# EAGLE design fac_relay (EAGLE 7.6.0)
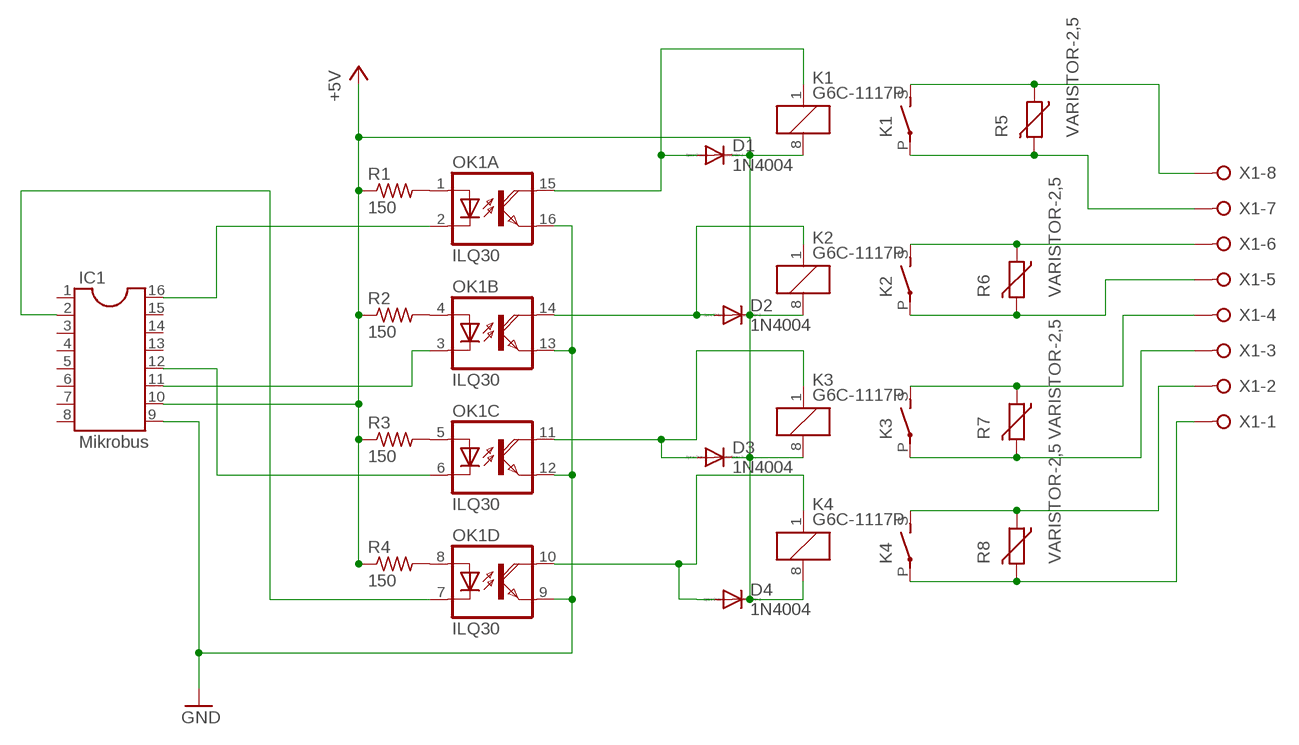
[diagram p0: schematic, sheet 1]

## Parts
D1  1N4004  [DO41-10]
D2  1N4004  [DO41-10]
D3  1N4004  [DO41-10]
D4  1N4004  [DO41-10]
IC1  Mikrobus  DIL16S  [SOCKET-16]
K1  G6C-1117P  [G6C-1117P]
K2  G6C-1117P  [G6C-1117P]
K3  G6C-1117P  [G6C-1117P]
K4  G6C-1117P  [G6C-1117P]
OK1  ILQ30  [DIL16]
R1  150  R-US_0204/5  [0204/5]
R2  150  R-US_0204/5  [0204/5]
R3  150  R-US_0204/5  [0204/5]
R4  150  R-US_0204/5  [0204/5]
R5  VARISTOR-2,5  [R-5]
R6  VARISTOR-2,5  [R-5]
R7  VARISTOR-2,5  [R-5]
R8  VARISTOR-2,5  [R-5]
X1  W237-08P  [W237-8P]

## Nets
+5V: D1.C D2.C D3.C D4.C IC1.10 K1.8 K2.8 K3.8 K4.8 R1.1 R2.1 R3.1 R4.1
GND: IC1.9 OK1.9(D:EMI) OK1.12(C:EMI) OK1.13(B:EMI) OK1.16(A:EMI)
N$1: OK1.1(A:A) R1.2
N$2: OK1.4(B:A) R2.2
N$3: OK1.5(C:A) R3.2
N$4: OK1.8(D:A) R4.2
N$5: IC1.16 OK1.2(A:C)
N$6: IC1.11 OK1.3(B:C)
N$7: IC1.12 OK1.6(C:C)
N$8: IC1.2 OK1.7(D:C)
N$9: K1.S(2:S) R5.1 X1.8
N$10: K1.P(2:P) R5.2 X1.7
N$11: D1.A K1.1 OK1.15(A:COL)
N$12: D2.A K2.1 OK1.14(B:COL)
N$13: D3.A K3.1 OK1.11(C:COL)
N$14: D4.A K4.1 OK1.10(D:COL)
N$15: K2.S(2:S) R6.1 X1.6
N$16: K2.P(2:P) R6.2 X1.5
N$17: K3.S(2:S) R7.1 X1.4
N$18: K3.P(2:P) R7.2 X1.3
N$19: K4.S(2:S) R8.1 X1.2
N$20: K4.P(2:P) R8.2 X1.1
Unconnected: IC1.1 IC1.3 IC1.4 IC1.5 IC1.6 IC1.7 IC1.8 IC1.13 IC1.14 IC1.15

## Library data of the parts
D1-D4 = diode:1N4004: DIODE general purpose rectifier, 1 A
IC1 = ic-package:DIL16: Dual In Line / Socket
K1-K4 = relay:G6C-1117P: RELAY 1 x norm. open, 10 A/240 V, Omron; OC_FARNELL: unknown; OC_NEWARK: unknown
OK1 = optocoupler:ILQ30: SIEMENS OPTO COUPLER; MF: VISHAY/TELEFUNKEN; MPN: ILQ30; OC_FARNELL: 1612449; OC_NEWARK: 58K1688
R1-R4 = resistor:R-US_: RESISTOR, American symbol
R5-R8 = varistor:VARISTOR: VARISTOR
X1 = con-wago-508:W237-08P: WAGO SREW CLAMP; OC_FARNELL: unknown; OC_NEWARK: unknown

## Board
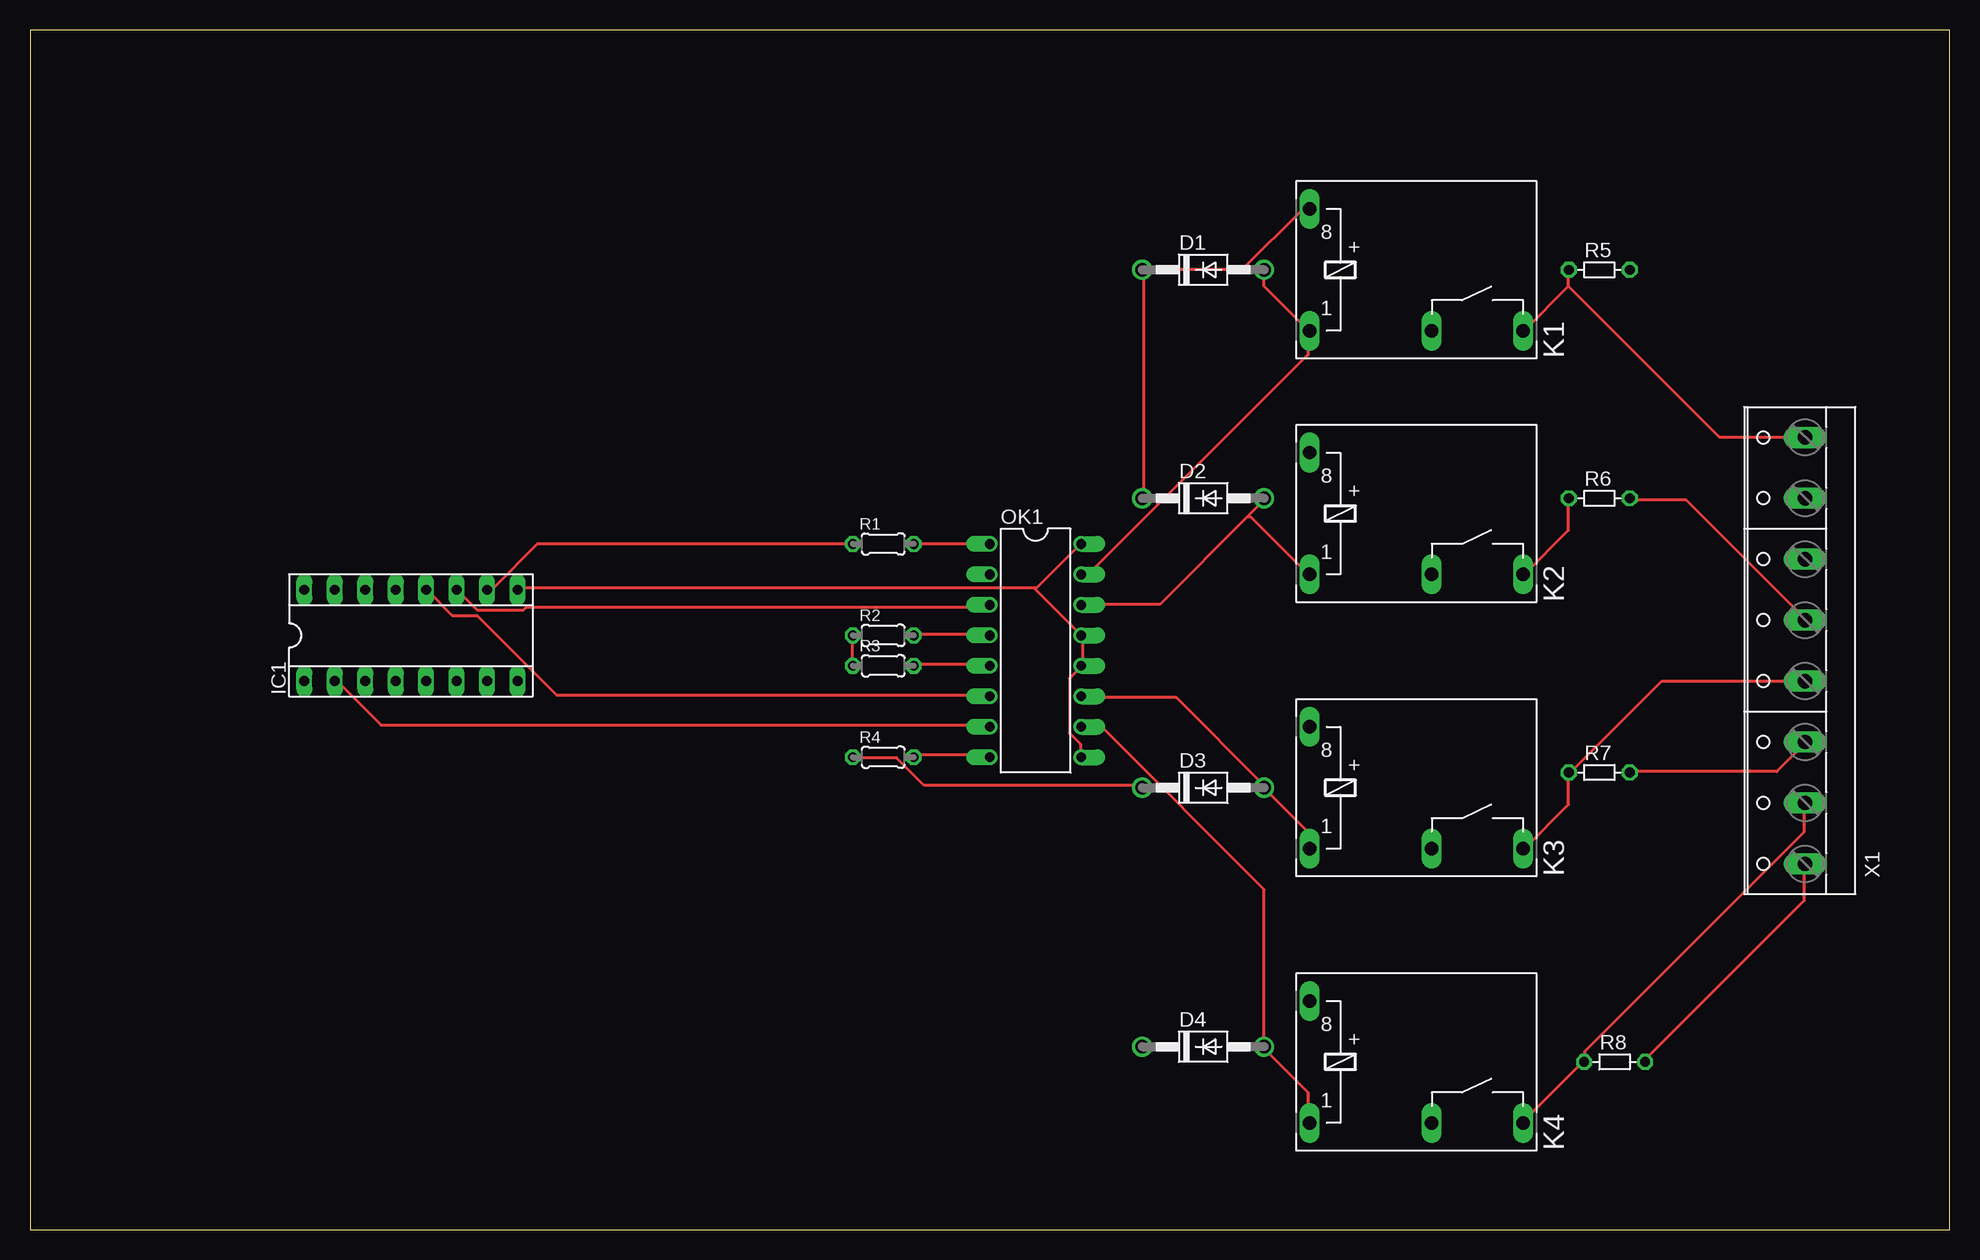
[diagram p1: board, top side]
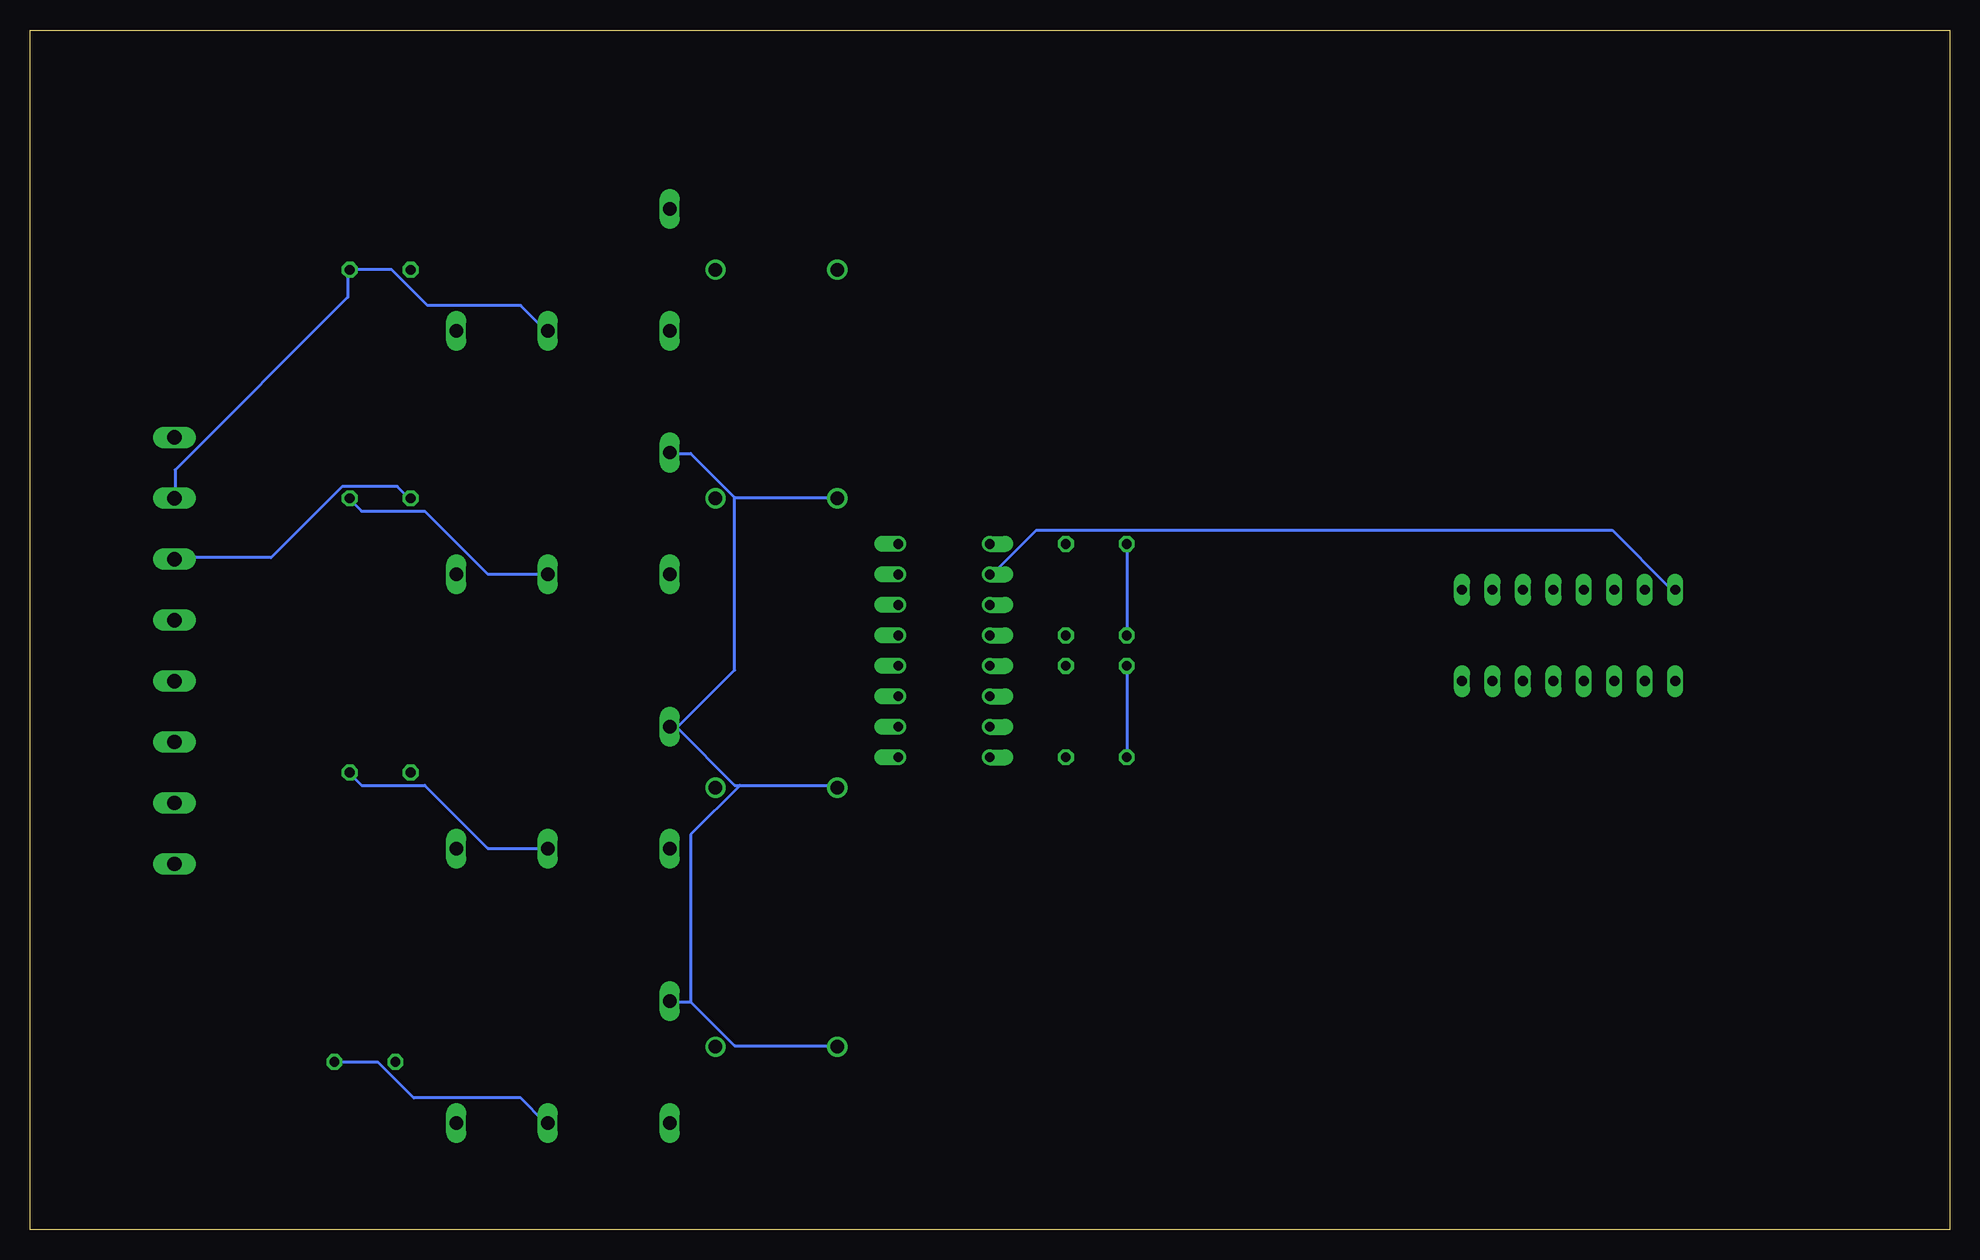
[diagram p2: board, bottom side, seen from below]

Size 160 x 100 mm. Coordinates in mm from the lower left corner, seen from the top.
Outline: 0,0 160,0 160,100 0,100 0,0
Copper layers (1*16): Top 0.035mm / dielectric 1.5mm / Bottom 0.035mm
Design rules "default": minimum track width 10mil, minimum drill 24mil, track to track 8mil, track to pad 8mil, pad to pad 8mil, via to via 8mil, smd to smd 8mil, copper to edge 40mil, drill to drill 8mil, minimum pad ring 10mil, minimum via ring 8mil, stop-mask expansion 4mil, vias tented up to drill 0mil, thermal gap 10mil

### Footprints (pad centres in the part's own frame; a part is rotated, then mirrored left to right if it is on the bottom)
DO41-10 = drill 1.118: A 5.08,0; C -5.08,0
SOCKET-16 = drill 0.813 long: 1 -8.89,-3.81; 2 -6.35,-3.81; 3 -3.81,-3.81; 4 -1.27,-3.81; 5 1.27,-3.81; 6 3.81,-3.81; 7 6.35,-3.81; 8 8.89,-3.81; 9 8.89,3.81; 10 6.35,3.81; 11 3.81,3.81; 12 1.27,3.81; 13 -1.27,3.81; 14 -3.81,3.81; 15 -6.35,3.81; 16 -8.89,3.81
G6C-1117P = drill 1.118 long: 1 -8.89,-5.08; 8 -8.89,5.08; P 1.27,-5.08; S 8.89,-5.08
DIL16 = drill 0.813 offset: 1 -8.89,-3.81; 2 -6.35,-3.81; 3 -3.81,-3.81; 4 -1.27,-3.81; 5 1.27,-3.81; 6 3.81,-3.81; 7 6.35,-3.81; 8 8.89,-3.81; 9 8.89,3.81; 10 6.35,3.81; 11 3.81,3.81; 12 1.27,3.81; 13 -1.27,3.81; 14 -3.81,3.81; 15 -6.35,3.81; 16 -8.89,3.81
0204/5 = drill 0.813 octagon: 1 -2.54,0; 2 2.54,0
R-5 = drill 0.813 octagon: 1 -2.54,0; 2 2.54,0
W237-8P = drill 1.194 long: 1 -17.78,-0.635; 2 -12.7,-0.635; 3 -7.62,-0.635; 4 -2.54,-0.635; 5 2.54,-0.635; 6 7.62,-0.635; 7 12.7,-0.635; 8 17.78,-0.635

### Placement (x,y rotation side)
D1  97.79,80.01 0 top
D2  97.79,60.96 0 top
D3  97.79,36.83 0 top
D4  97.79,15.24 0 top
IC1  31.75,49.53 0 top
K1  115.57,80.01 0 top
K2  115.57,59.69 0 top
K3  115.57,36.83 0 top
K4  115.57,13.97 0 top
OK1  83.82,48.26 270 top
R1  71.12,57.15 0 top
R2  71.12,49.53 0 top
R3  71.12,46.99 0 top
R4  71.12,39.37 0 top
R5  130.81,80.01 0 top
R6  130.81,60.96 0 top
R7  130.81,38.1 0 top
R8  132.08,13.97 0 top
X1  147.32,48.26 90 top

### Tracks (layer width: path | path; a pad name or v marks a point on that pad's centre or on a via)
+5V
  Top 0.254: R3.1 R2.1 | R1.1 42.29,57.15 38.63,53.49 38.18,53.49 IC1.10 | 92.81,80.01 101.04,80.01 106.07,85.04 106.53,85.04 K1.8 | 92.81,80.01 92.81,61.04 D2.C | 92.81,80.01 D1.C | R4.1 68.58,39.32 72.24,39.32 74.52,37.03 92.58,37.03 D3.C
  Bottom 0.254: R3.1 R4.1 | R1.1 R2.1 | 101.27,61.04 92.81,61.04 D2.C | 101.27,61.04 104.93,64.69 106.53,64.69 K2.8 | 104.93,18.97 101.27,15.32 92.81,15.32 D4.C | 104.93,18.97 106.53,18.97 K4.8 | 100.81,37.03 101.27,37.03 106.07,41.83 | 100.81,37.03 92.81,37.03 D3.C | 106.07,41.83 106.53,41.83 K3.8 106.07,41.83 | 104.93,18.97 104.93,32.92 100.81,37.03 | 101.27,61.04 101.27,46.63 106.07,41.83
GND
  Top 0.254: OK1.9 87.55,39.55 87.55,40.46 86.64,41.38 86.64,45.95 87.55,46.86 OK1.12 87.78,47.09 87.78,49.38 OK1.13 83.67,53.49 | 83.67,53.49 83.9,53.49 87.55,57.15 OK1.16 | 83.67,53.49 40.69,53.49 IC1.9
N$1
  Top 0.254: OK1.1 R1.2
N$2
  Top 0.254: R2.2 73.84,49.61 80.01,49.61 OK1.4
N$3
  Top 0.254: R3.2 73.84,47.09 80.01,47.09 OK1.5
N$4
  Top 0.254: R4.2 73.84,39.55 80.01,39.55 OK1.8
N$5
  Bottom 0.254: IC1.16 22.86,53.49 23.32,53.49 28.12,58.29 76.12,58.29 80.01,54.41 OK1.2
N$6
  Top 0.254: OK1.3 80.01,51.89 41.38,51.89 41.15,51.66 37.26,51.66 35.66,53.26 IC1.11
N$7
  Top 0.254: OK1.6 80.01,44.58 43.89,44.58 37.26,51.21 35.2,51.21 33.15,53.26 IC1.12
N$8
  Top 0.254: OK1.7 80.01,42.06 29.26,42.06 25.6,45.72 IC1.2
N$9
  Top 0.254: 128.25,78.64 128.25,80.01 R5.1 | 128.25,78.64 124.59,74.98 K1.S | 128.25,78.64 140.82,66.06 147.9,66.06 X1.8
N$10
  Bottom 0.254: K1.P 117.04,74.98 119.1,77.04 126.87,77.04 129.84,80.01 R5.2 133.5,80.01 133.5,77.72 147.9,63.32 147.9,61.04 X1.7
N$11
  Top 0.254: OK1.15 87.78,54.63 88.24,54.63 106.53,72.92 106.53,74.75 K1.1 106.53,74.98 102.87,78.64 D1.A
N$12
  Top 0.254: 101.5,59.44 102.87,60.81 D2.A | 101.5,59.44 94.18,52.12 87.78,52.12 OK1.14 | 101.5,59.44 101.73,59.44 106.53,54.63 K2.1
N$13
  Top 0.254: OK1.11 87.78,44.35 95.56,44.35 102.87,37.03 D3.A 102.87,36.8 106.53,33.15 106.53,31.77 K3.1
N$14
  Top 0.254: OK1.10 87.78,41.83 89.38,41.83 102.87,28.35 D4.A 102.87,15.09 106.53,11.43 106.53,8.91 K4.1
N$15
  Top 0.254: R6.1 128.25,60.81 128.25,58.29 124.59,54.63 K2.S
  Bottom 0.254: X1.6 147.9,56.01 139.9,56.01 133.96,61.95 129.39,61.95 128.47,61.04 R6.1
N$16
  Top 0.254: R6.2 133.5,60.81 138.07,60.81 147.9,50.98 X1.5
  Bottom 0.254: K2.P 117.04,54.63 121.84,54.63 127.1,59.89 132.36,59.89 133.27,60.81 R6.2
N$17
  Top 0.254: K3.S 124.59,31.77 128.25,35.43 128.25,37.95 R7.1 128.47,38.18 136.02,45.72 X1.4
N$18
  Top 0.254: R7.2 133.5,38.18 145.62,38.18 147.9,40.46 X1.3
  Bottom 0.254: K3.P 117.04,31.77 121.84,31.77 127.1,37.03 132.36,37.03 133.27,37.95 R7.2
N$19
  Top 0.254: K4.S 124.36,8.91 129.39,13.95 R8.1 129.62,14.17 129.62,14.86 147.9,33.15 147.9,35.43 X1.2
N$20
  Top 0.254: X1.1 147.9,30.4 147.9,27.43 134.65,14.17 R8.2
  Bottom 0.254: R8.2 134.42,13.95 130.99,13.95 128.02,10.97 119.1,10.97 117.04,8.91 K4.P